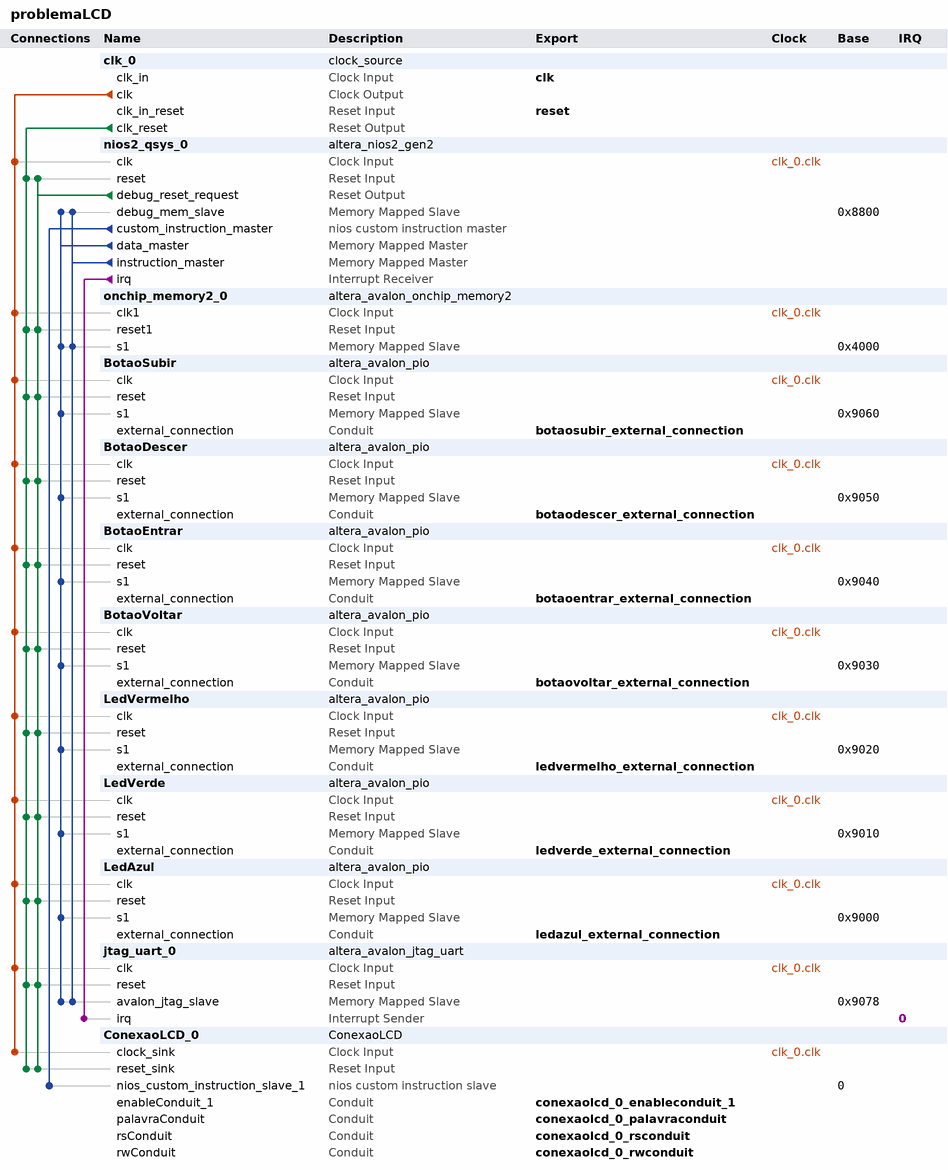
[diagram p0: system contents]
# Platform Designer (Qsys) system problemaLCD, Cyclone IV E EP4CE30F23C7
# Parameters at their usual value, and those the tool derives, are not listed.
package require -exact qsys 18.1
create_system problemaLCD
set_project_property DEVICE_FAMILY {Cyclone IV E}
set_project_property DEVICE EP4CE30F23C7

add_instance clk_0 clock_source 18.1
set_instance_parameter_value clk_0 clockFrequency 50000000

add_instance nios2_qsys_0 altera_nios2_gen2 18.1
set_instance_parameter_value nios2_qsys_0 dcache_size 2048
set_instance_parameter_value nios2_qsys_0 exceptionSlave onchip_memory2_0.s1
set_instance_parameter_value nios2_qsys_0 icache_size 4096
set_instance_parameter_value nios2_qsys_0 impl Tiny
set_instance_parameter_value nios2_qsys_0 resetSlave onchip_memory2_0.s1
set_instance_parameter_value nios2_qsys_0 setting_activateTrace true

add_instance onchip_memory2_0 altera_avalon_onchip_memory2 18.1
set_instance_parameter_value onchip_memory2_0 dataWidth 32
set_instance_parameter_value onchip_memory2_0 dualPort false
set_instance_parameter_value onchip_memory2_0 initMemContent true
set_instance_parameter_value onchip_memory2_0 initializationFileName onchip_mem.hex
set_instance_parameter_value onchip_memory2_0 memorySize 16192

add_instance BotaoSubir altera_avalon_pio 18.1
set_instance_parameter_value BotaoSubir direction Input
set_instance_parameter_value BotaoSubir width 1

add_instance BotaoDescer altera_avalon_pio 18.1
set_instance_parameter_value BotaoDescer direction Input
set_instance_parameter_value BotaoDescer width 1

add_instance BotaoEntrar altera_avalon_pio 18.1
set_instance_parameter_value BotaoEntrar direction Input
set_instance_parameter_value BotaoEntrar width 1

add_instance BotaoVoltar altera_avalon_pio 18.1
set_instance_parameter_value BotaoVoltar direction Input
set_instance_parameter_value BotaoVoltar width 1

add_instance LedVermelho altera_avalon_pio 18.1
set_instance_parameter_value LedVermelho direction Output
set_instance_parameter_value LedVermelho width 1

add_instance LedVerde altera_avalon_pio 18.1
set_instance_parameter_value LedVerde direction Output
set_instance_parameter_value LedVerde width 1

add_instance LedAzul altera_avalon_pio 18.1
set_instance_parameter_value LedAzul direction Output
set_instance_parameter_value LedAzul width 1

add_instance jtag_uart_0 altera_avalon_jtag_uart 18.1
set_instance_parameter_value jtag_uart_0 simInteractiveOptions NO_INTERACTIVE_WINDOWS

add_instance ConexaoLCD_0 ConexaoLCD 1.0

# connections
add_connection clk_0.clk BotaoDescer.clk clock
add_connection clk_0.clk BotaoEntrar.clk clock
add_connection clk_0.clk BotaoSubir.clk clock
add_connection clk_0.clk BotaoVoltar.clk clock
add_connection clk_0.clk ConexaoLCD_0.clock_sink clock
add_connection clk_0.clk jtag_uart_0.clk clock
add_connection clk_0.clk LedAzul.clk clock
add_connection clk_0.clk LedVerde.clk clock
add_connection clk_0.clk LedVermelho.clk clock
add_connection clk_0.clk nios2_qsys_0.clk clock
add_connection clk_0.clk onchip_memory2_0.clk1 clock
add_connection clk_0.clk_reset BotaoDescer.reset reset
add_connection clk_0.clk_reset BotaoEntrar.reset reset
add_connection clk_0.clk_reset BotaoSubir.reset reset
add_connection clk_0.clk_reset BotaoVoltar.reset reset
add_connection clk_0.clk_reset ConexaoLCD_0.reset_sink reset
add_connection clk_0.clk_reset jtag_uart_0.reset reset
add_connection clk_0.clk_reset LedAzul.reset reset
add_connection clk_0.clk_reset LedVerde.reset reset
add_connection clk_0.clk_reset LedVermelho.reset reset
add_connection clk_0.clk_reset nios2_qsys_0.reset reset
add_connection clk_0.clk_reset onchip_memory2_0.reset1 reset
add_connection nios2_qsys_0.debug_reset_request BotaoDescer.reset reset
add_connection nios2_qsys_0.debug_reset_request BotaoEntrar.reset reset
add_connection nios2_qsys_0.debug_reset_request BotaoSubir.reset reset
add_connection nios2_qsys_0.debug_reset_request BotaoVoltar.reset reset
add_connection nios2_qsys_0.debug_reset_request ConexaoLCD_0.reset_sink reset
add_connection nios2_qsys_0.debug_reset_request jtag_uart_0.reset reset
add_connection nios2_qsys_0.debug_reset_request LedAzul.reset reset
add_connection nios2_qsys_0.debug_reset_request LedVerde.reset reset
add_connection nios2_qsys_0.debug_reset_request LedVermelho.reset reset
add_connection nios2_qsys_0.debug_reset_request nios2_qsys_0.reset reset
add_connection nios2_qsys_0.debug_reset_request onchip_memory2_0.reset1 reset
add_connection nios2_qsys_0.data_master BotaoDescer.s1 avalon
set_connection_parameter_value nios2_qsys_0.data_master/BotaoDescer.s1 baseAddress 0x9050
add_connection nios2_qsys_0.data_master BotaoEntrar.s1 avalon
set_connection_parameter_value nios2_qsys_0.data_master/BotaoEntrar.s1 baseAddress 0x9040
add_connection nios2_qsys_0.data_master BotaoSubir.s1 avalon
set_connection_parameter_value nios2_qsys_0.data_master/BotaoSubir.s1 baseAddress 0x9060
add_connection nios2_qsys_0.data_master BotaoVoltar.s1 avalon
set_connection_parameter_value nios2_qsys_0.data_master/BotaoVoltar.s1 baseAddress 0x9030
add_connection nios2_qsys_0.data_master jtag_uart_0.avalon_jtag_slave avalon
set_connection_parameter_value nios2_qsys_0.data_master/jtag_uart_0.avalon_jtag_slave baseAddress 0x9078
add_connection nios2_qsys_0.data_master LedAzul.s1 avalon
set_connection_parameter_value nios2_qsys_0.data_master/LedAzul.s1 baseAddress 0x9000
add_connection nios2_qsys_0.data_master LedVerde.s1 avalon
set_connection_parameter_value nios2_qsys_0.data_master/LedVerde.s1 baseAddress 0x9010
add_connection nios2_qsys_0.data_master LedVermelho.s1 avalon
set_connection_parameter_value nios2_qsys_0.data_master/LedVermelho.s1 baseAddress 0x9020
add_connection nios2_qsys_0.data_master nios2_qsys_0.debug_mem_slave avalon
set_connection_parameter_value nios2_qsys_0.data_master/nios2_qsys_0.debug_mem_slave baseAddress 0x8800
add_connection nios2_qsys_0.data_master onchip_memory2_0.s1 avalon
set_connection_parameter_value nios2_qsys_0.data_master/onchip_memory2_0.s1 baseAddress 0x4000
add_connection nios2_qsys_0.instruction_master jtag_uart_0.avalon_jtag_slave avalon
set_connection_parameter_value nios2_qsys_0.instruction_master/jtag_uart_0.avalon_jtag_slave baseAddress 0x9078
add_connection nios2_qsys_0.instruction_master nios2_qsys_0.debug_mem_slave avalon
set_connection_parameter_value nios2_qsys_0.instruction_master/nios2_qsys_0.debug_mem_slave baseAddress 0x8800
add_connection nios2_qsys_0.instruction_master onchip_memory2_0.s1 avalon
set_connection_parameter_value nios2_qsys_0.instruction_master/onchip_memory2_0.s1 baseAddress 0x4000
add_connection nios2_qsys_0.irq jtag_uart_0.irq interrupt
set_connection_parameter_value nios2_qsys_0.irq/jtag_uart_0.irq irqNumber 0
add_connection nios2_qsys_0.custom_instruction_master ConexaoLCD_0.nios_custom_instruction_slave_1 nios_custom_instruction
set_connection_parameter_value nios2_qsys_0.custom_instruction_master/ConexaoLCD_0.nios_custom_instruction_slave_1 CIName conexaolcd_0
set_connection_parameter_value nios2_qsys_0.custom_instruction_master/ConexaoLCD_0.nios_custom_instruction_slave_1 baseAddress 0

# exported interfaces
add_interface botaodescer_external_connection conduit end
set_interface_property botaodescer_external_connection EXPORT_OF BotaoDescer.external_connection
add_interface botaoentrar_external_connection conduit end
set_interface_property botaoentrar_external_connection EXPORT_OF BotaoEntrar.external_connection
add_interface botaosubir_external_connection conduit end
set_interface_property botaosubir_external_connection EXPORT_OF BotaoSubir.external_connection
add_interface botaovoltar_external_connection conduit end
set_interface_property botaovoltar_external_connection EXPORT_OF BotaoVoltar.external_connection
add_interface clk clock sink
set_interface_property clk EXPORT_OF clk_0.clk_in
add_interface conexaolcd_0_enableconduit_1 conduit end
set_interface_property conexaolcd_0_enableconduit_1 EXPORT_OF ConexaoLCD_0.enableConduit_1
add_interface conexaolcd_0_palavraconduit conduit end
set_interface_property conexaolcd_0_palavraconduit EXPORT_OF ConexaoLCD_0.palavraConduit
add_interface conexaolcd_0_rsconduit conduit end
set_interface_property conexaolcd_0_rsconduit EXPORT_OF ConexaoLCD_0.rsConduit
add_interface conexaolcd_0_rwconduit conduit end
set_interface_property conexaolcd_0_rwconduit EXPORT_OF ConexaoLCD_0.rwConduit
add_interface ledazul_external_connection conduit end
set_interface_property ledazul_external_connection EXPORT_OF LedAzul.external_connection
add_interface ledverde_external_connection conduit end
set_interface_property ledverde_external_connection EXPORT_OF LedVerde.external_connection
add_interface ledvermelho_external_connection conduit end
set_interface_property ledvermelho_external_connection EXPORT_OF LedVermelho.external_connection
add_interface reset reset sink
set_interface_property reset EXPORT_OF clk_0.clk_in_reset

set_interconnect_requirement {$system} qsys_mm.clockCrossingAdapter HANDSHAKE
set_interconnect_requirement {$system} qsys_mm.insertDefaultSlave false
set_interconnect_requirement {$system} qsys_mm.maxAdditionalLatency 1

save_system problemaLCD.qsys
